# Altium schematic sheet lcd.SchDoc: LCD
size A4; Date: 10.06.2025; CheckedBy: BCY; DrawnBy: miaow; DocumentNumber: 8; Revision: v0.0.1; SheetNumber: 8; SheetTotal: 12; Sample: A0; Url: github.com/miaow-cn/pcb-lib; Liscense: GPLv3; Board: MIAOW FOC BOARD; BoardType: MAIN_PCB; Desc: fpc socket for rgb888 lcd & touch interface
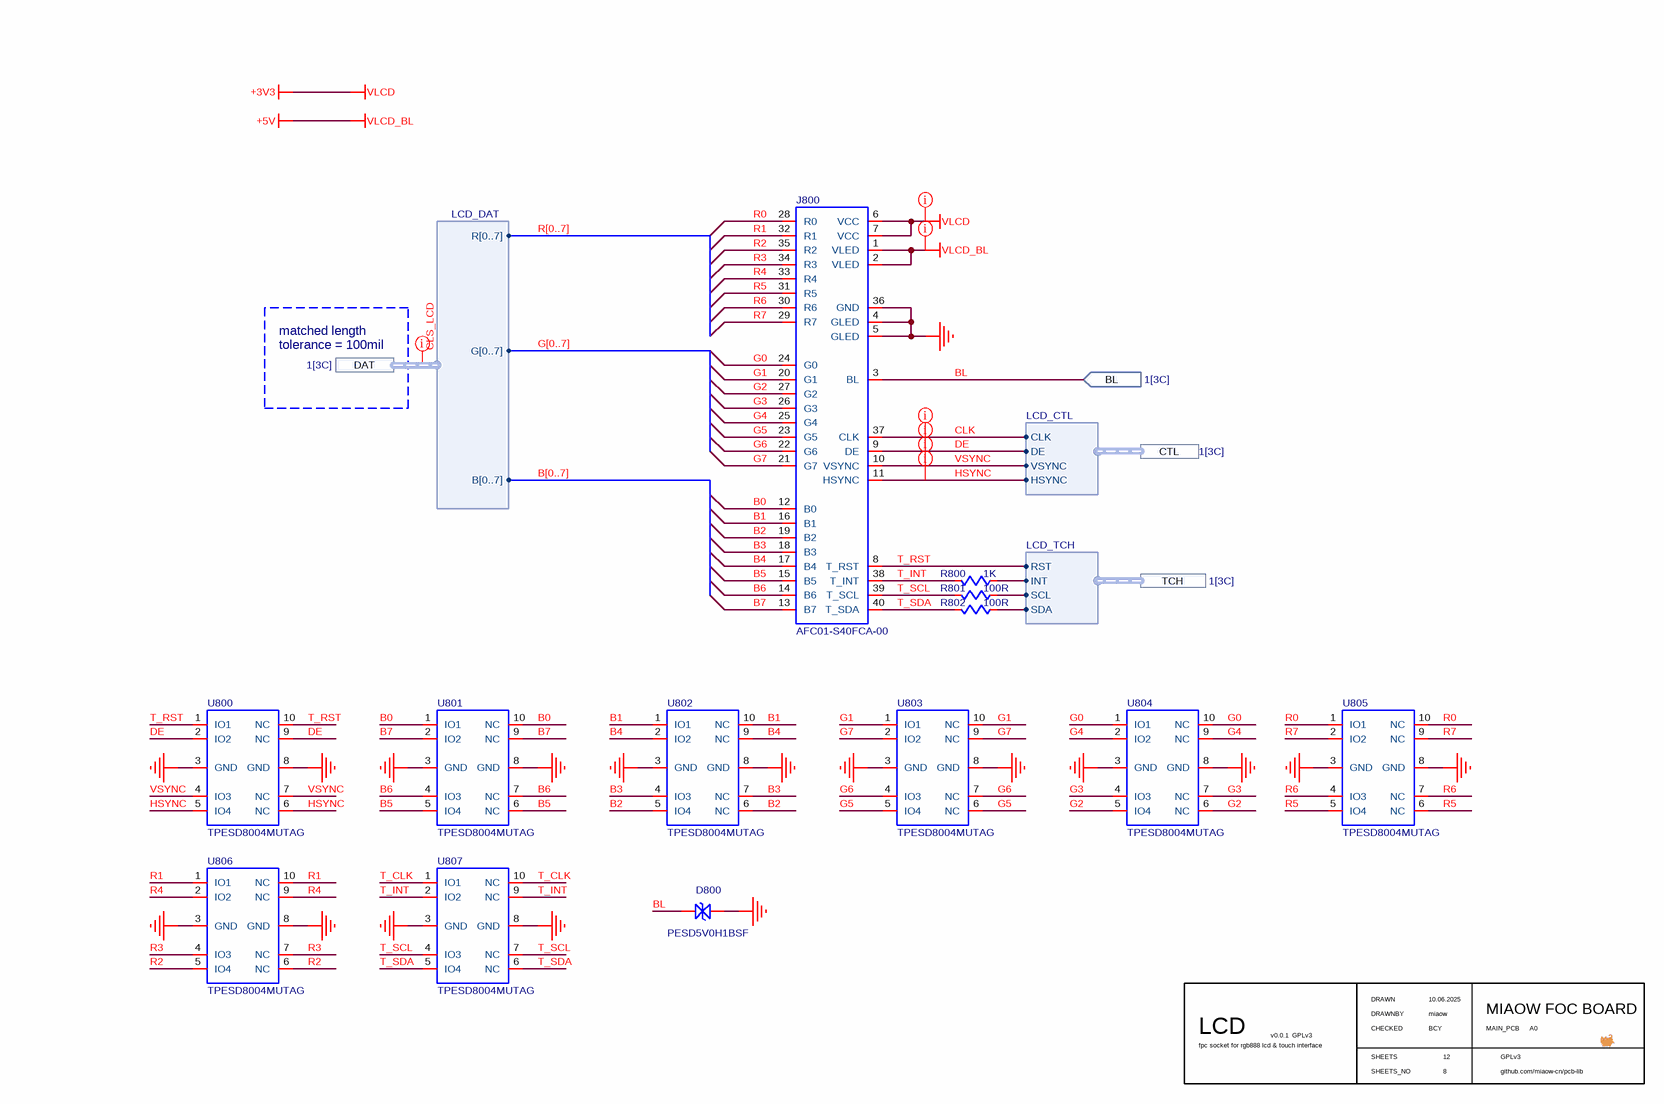
[diagram p0: lcd.SchDoc]

## Parts
D800  PESD5V0H1BSF  [PESD5V0H1BSF]
J800  AFC01-S40FCA-00  [AFC01-S40FCA-00]
R800  value 1K  [R0402]  (hidden comment: R)
R801  value 100R  [R0402]  (hidden comment: R)
R802  value 100R  [R0402]  (hidden comment: R)
U800  TPESD8004MUTAG  [TPESD8004MUTAG]
U801  TPESD8004MUTAG  [TPESD8004MUTAG]
U802  TPESD8004MUTAG  [TPESD8004MUTAG]
U803  TPESD8004MUTAG  [TPESD8004MUTAG]
U804  TPESD8004MUTAG  [TPESD8004MUTAG]
U805  TPESD8004MUTAG  [TPESD8004MUTAG]
U806  TPESD8004MUTAG  [TPESD8004MUTAG]
U807  TPESD8004MUTAG  [TPESD8004MUTAG]

## Ports
BL (in, see 1[3C]), CTL (harness LCD_CTL, see 1[3C]), DAT (harness LCD_DAT, see 1[3C]), TCH (harness LCD_TCH, see 1[3C])

## Harnesses
LCD_DAT: R[0..7], G[0..7], B[0..7]
LCD_CTL: HSYNC, VSYNC, DE, CLK
LCD_TCH: SDA, SCL, INT, RST

## Nets
+3V3: J800.6(VCC) J800.7(VCC)  [also labelled VLCD]
+5V: J800.1(VLED) J800.2(VLED)  [also labelled VLCD_BL]
GND: D800.2 J800.4(GLED) J800.5(GLED) J800.36(GND) U800.3(GND) U800.8(GND) U801.3(GND) U801.8(GND) U802.3(GND) U802.8(GND) U803.3(GND) U803.8(GND) U804.3(GND) U804.8(GND) U805.3(GND) U805.8(GND) U806.3(GND) U806.8(GND) U807.3(GND) U807.8(GND)
B0: J800.12(B0) U801.1(IO1) U801.10(NC)
B1: J800.16(B1) U802.1(IO1) U802.10(NC)
B2: J800.19(B2) U802.5(IO4) U802.6(NC)
B3: J800.18(B3) U802.4(IO3) U802.7(NC)
B4: J800.17(B4) U802.2(IO2) U802.9(NC)
B5: J800.15(B5) U801.5(IO4) U801.6(NC)
B6: J800.14(B6) U801.4(IO3) U801.7(NC)
B7: J800.13(B7) U801.2(IO2) U801.9(NC)
BL: D800.1 J800.3(BL) ; port BL
CLK: J800.37(CLK) ; port CTL.CLK
DE: J800.9(DE) U800.2(IO2) U800.9(NC) ; port CTL.DE
G0: J800.24(G0) U804.1(IO1) U804.10(NC)
G1: J800.20(G1) U803.1(IO1) U803.10(NC)
G2: J800.27(G2) U804.5(IO4) U804.6(NC)
G3: J800.26(G3) U804.4(IO3) U804.7(NC)
G4: J800.25(G4) U804.2(IO2) U804.9(NC)
G5: J800.23(G5) U803.5(IO4) U803.6(NC)
G6: J800.22(G6) U803.4(IO3) U803.7(NC)
G7: J800.21(G7) U803.2(IO2) U803.9(NC)
HSYNC: J800.11(HSYNC) U800.5(IO4) U800.6(NC) ; port CTL.HSYNC
R0: J800.28(R0) U805.1(IO1) U805.10(NC)
R1: J800.32(R1) U806.1(IO1) U806.10(NC)
R2: J800.35(R2) U806.5(IO4) U806.6(NC)
R3: J800.34(R3) U806.4(IO3) U806.7(NC)
R4: J800.33(R4) U806.2(IO2) U806.9(NC)
R5: J800.31(R5) U805.5(IO4) U805.6(NC)
R6: J800.30(R6) U805.4(IO3) U805.7(NC)
R7: J800.29(R7) U805.2(IO2) U805.9(NC)
T_CLK: U807.1(IO1) U807.10(NC)
T_INT: J800.38(T_INT) R800.1 U807.2(IO2) U807.9(NC)
T_RST: J800.8(T_RST) U800.1(IO1) U800.10(NC) ; port TCH.RST
T_SCL: J800.39(T_SCL) R801.1 U807.4(IO3) U807.7(NC)
T_SDA: J800.40(T_SDA) R802.1 U807.5(IO4) U807.6(NC)
VSYNC: J800.10(VSYNC) U800.4(IO3) U800.7(NC) ; port CTL.VSYNC
NetR800_2: R800.2 ; port TCH.INT
NetR801_2: R801.2 ; port TCH.SCL
NetR802_2: R802.2 ; port TCH.SDA

## Buses and harness runs
bus B[0..7]
bus G[0..7]
bus R[0..7]

## Layout directives
net class CLS_EMMC: CLK, DE, HSYNC, VSYNC
net class CLS_LCD: (no net found under the mark)
net class CLS_PWR: +3V3, +5V

## Notes on the sheet
- matched length tolerance = 100mil
- DRAWN
- CHECKED
- DRAWNBY
- SHEETS
- SHEETS_NO

## Library data of the parts
D800 = PESD5V0H1BSF: TVS/ESD; Supplier 1: LCSC; Supplier Part Number 1: C477989
J800 = FPC-RGBLCD: Supplier 1: LCSC; Supplier Part Number 1: C262674
R800-R802 = R: precision: 1%
U800-U807 = TPESD8004MUTAG: TVS/ESD; Supplier 1: LCSC; Supplier Part Number 1: C2827679